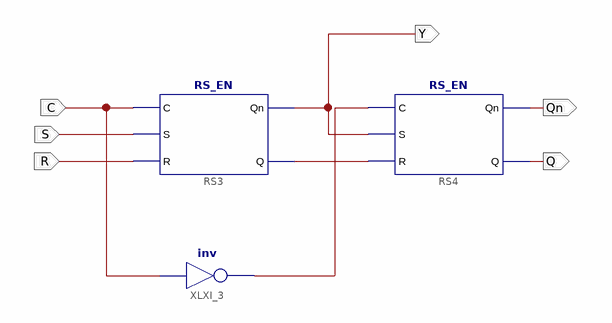
[diagram p0: schematic sheet 1]
// Xilinx ISE schematic RS_Trig.sch (kintex7) as structural Verilog: 3 symbols, 6 ports
module RS_Trig (
  input  C,
  input  S,
  input  R,
  output Qn,
  output Q,
  output Y
);

  wire XLXN_9, XLXN_11;

  RS_EN RS3 (.C(C), .S(S), .R(R), .Qn(Y), .Q(XLXN_11));
  RS_EN RS4 (.C(XLXN_9), .S(Y), .R(XLXN_11), .Qn(Qn), .Q(Q));
  not XLXI_3 (XLXN_9, C);
endmodule
